# EasyEDA Pro project MCU.epro

# Schematic schematic1
Create Date: 2024-06-15; Page Name: P1; Project Name: OpenBedScanner; Schematic Name: schematic1; Update Date: 2024-06-15; Company: Cartographer3D; Page Size: A4; Version: V1.0
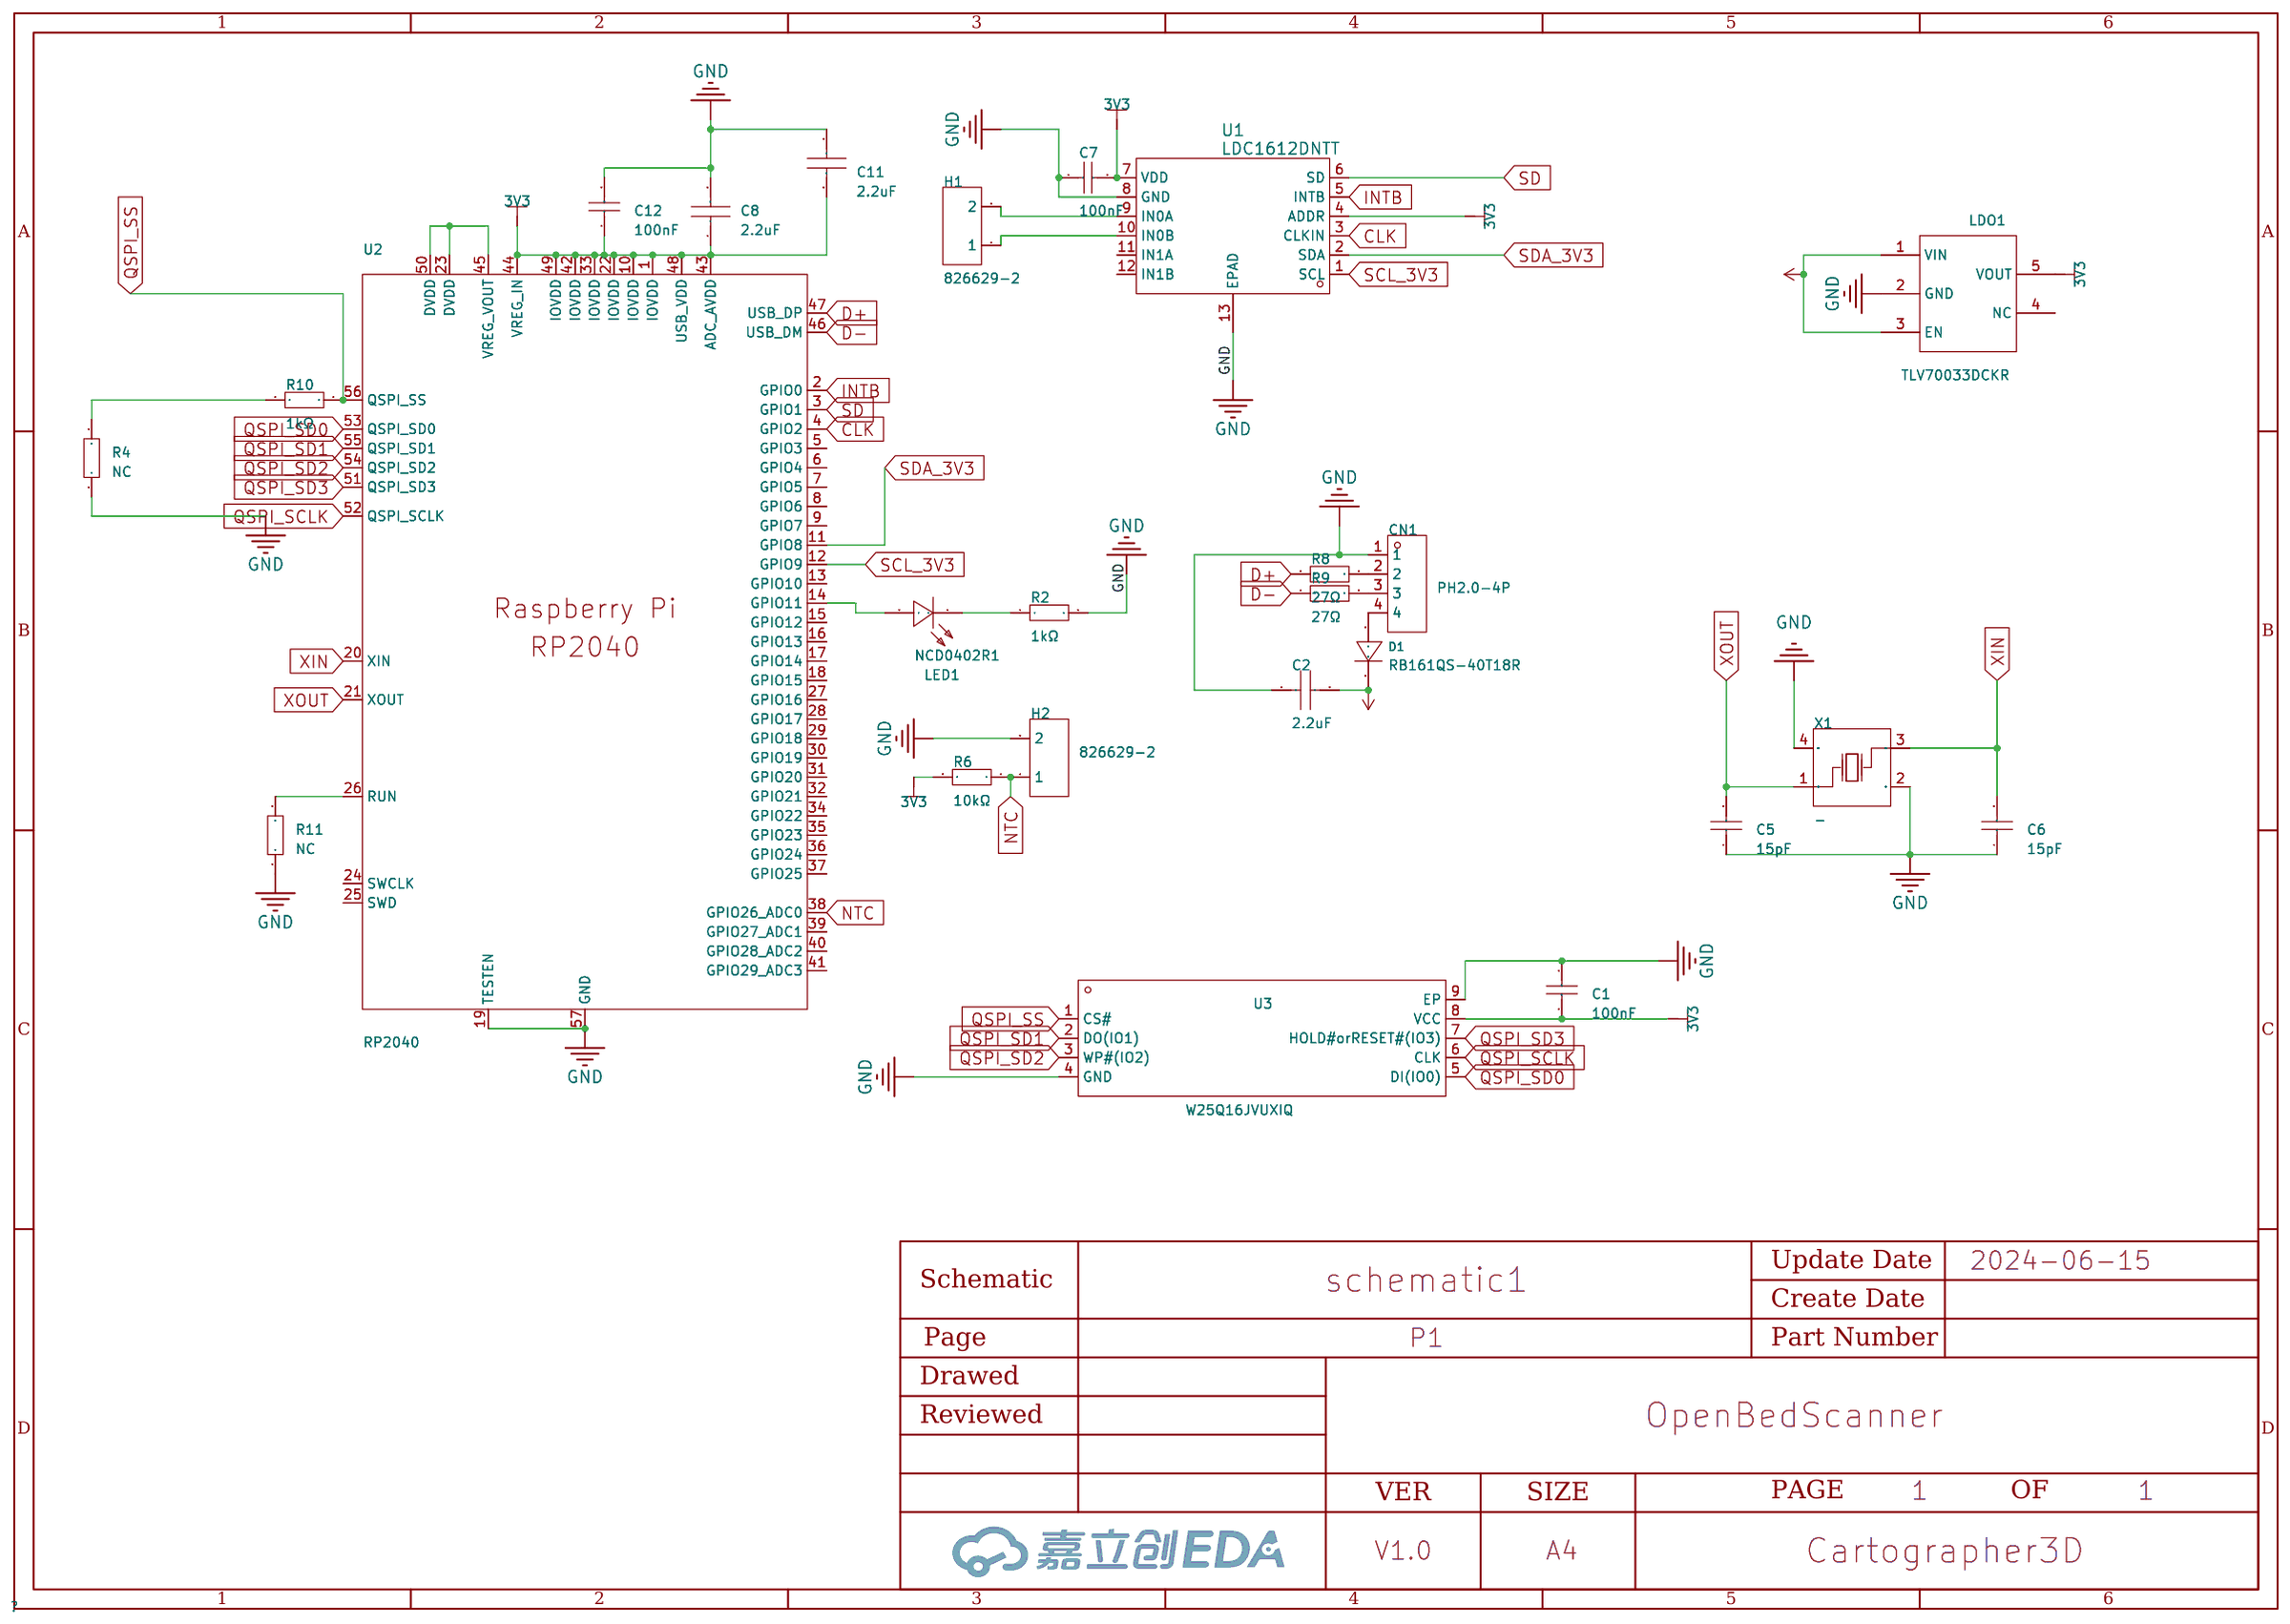
[diagram p0: schematic sheet]

## Parts
C1  100nF  [C0402]
C2  2.2uF  [C0402]
C5  15pF  [C0402]
C6  15pF  [C0402]
C7  100nF  [C0402]
C8  2.2uF  [C0402]
C11  2.2uF  [C0402]
C12  100nF  [C0402]
CN1  PH2.0-4P  [CONN-TH_PH2.0-4P]
D1  RB161QS-40T18R  [X2-DFN1006-2_L1.0-W0.6-P0.65-RD]
H1  826629-2  [HDR-TH_2P-P2.54-V-M-1]
H2  826629-2  [HDR-TH_2P-P2.54-V-M-1]
LDO1  TLV70033DCKR  [SC-70-5_L2.1-W1.3-P0.65-LS2.1-BR]
LED1  NCD0402R1  [R0402]
R2  1kΩ  [R0402]
R4  NC  [R0805]
R6  10kΩ  [R0402]
R8  27Ω  [R0402]
R9  27Ω  [R0402]
R10  1kΩ  [R0402]
R11  NC  [R0805]
U1  LDC1612DNTT  [WSON-12_L4.0-W4.0-P0.50-BL-EP]
U2  RP2040  [LQFN-56_L7.0-W7.0-P0.4-EP]
U3  W25Q16JVUXIQ  [USON-8_L3.0-W2.0-P0.50-BL-EP]
X1  -  [OSC-SMD_4P-L2.5-W2.0-BL]

## Library data of the parts
C1 C7 C12 = 0402B104K160NT: 容值:100nF;精度:±10%;额定电压:16V;材质(温度系数):X7R;; LCSC Part Name: 100nF ±10% 16V; Supplier Part: C41851; Manufacturer: FH(风华); Supplier Footprint: 0402; JLCPCB Part Class: Extended Part; Datasheet: https://atta.szlcsc.com/upload/public/pdf/source/20170923/C41851_1506149456453988767.pdf; Supplier: LCSC; Tolerance: ±10%; Voltage Rated: 16V; Temperature Coefficient: X7R
C2 C8 C11 = CL05A225MQ5NSNC: 容值:2.2uF;精度:±20%;额定电压:6.3V;材质(温度系数):X5R;; LCSC Part Name: 2.2uF ±20% 6.3V; Supplier Part: C12530; Manufacturer: SAMSUNG(三星); Supplier Footprint: 0402; JLCPCB Part Class: Basic Part; Datasheet: https://atta.szlcsc.com/upload/public/pdf/source/20160103/1457707666860.pdf; Supplier: LCSC; Tolerance: ±20%; Voltage Rated: 6.3V; Temperature Coefficient: X5R
C5 C6 = 0402CG150J500NT: 容值:15pF;精度:±5%;额定电压:50V;材质(温度系数):C0G;; LCSC Part Name: 15pF ±5% 50V; Supplier Part: C1548; Manufacturer: FH(风华); Supplier Footprint: 0402; JLCPCB Part Class: Basic Part; Datasheet: https://atta.szlcsc.com/upload/public/pdf/source/20170923/C1548_1506149266133988355.pdf; Supplier: LCSC; Tolerance: ±5%; Voltage Rated: 50V; Temperature Coefficient: C0G
CN1 = PH2.0-4P_C722763: LCSC Part Name: 4P 2.0mm; Supplier Part: C722763; Manufacturer: CAX(创都); JLCPCB Part Class: Extended Part; Datasheet: https://atta.szlcsc.com/upload/public/pdf/source/20200831/C722752_2CEED1D72592B01C53DF3269E60027F0.pdf; Supplier: LCSC
D1 = RB161QS-40T18R: Supplier Part: C2837790; Manufacturer: ROHM(罗姆); Supplier Footprint: 0402; JLCPCB Part Class: 扩展库; Supplier: LCSC
H1 H2 = 826629-2: 排数:单排;总PIN位数:2;间距:2.54mm;插针结构:1x2P;行距:-;安装类型:直插;圆针/方针:-;额定电流:-;额定电压:-;配合针长度:-;塑高:2.8mm;触头材质:黄铜;触头镀层:-;颜色:绿色;; LCSC Part Name: 2.54mm 1x2P 直插; Supplier Part: C86471; Manufacturer: TE Connectivity(美国泰科); Supplier Footprint: 插件,P=2.54mm; JLCPCB Part Class: Extended Part; Datasheet: https://atta.szlcsc.com/upload/public/pdf/source/20161105/1478330325829.pdf; Supplier: LCSC; Number of Rows: 单排; Number of Pins: 2; Pitch: 2.54mm; Pin Structure: 1x2P; Mounting Type: 直插; Insulation Height: 2.8mm; Contact Material: 黄铜; Color: 绿色
LDO1 = TLV70033DCKR: 输出类型:固定;最大输入电压:5.5V;输出电压:3.3V;最大输出电流:200mA;电源纹波抑制比(PSRR):68dB@(1kHz);输出极性:正极;; LCSC Part Name: 输入5.5V 输出3.3V 200mA; Supplier Part: C47945; Manufacturer: TI(德州仪器); Supplier Footprint: SC-70-5; JLCPCB Part Class: Extended Part; Datasheet: https://www.ti.com/cn/lit/gpn/tlv700; Supplier: LCSC; Output Type: 固定; Maximum Input Voltage: 5.5V; Output Voltage: 3.3V; MAX Output Current: 200mA; Power Supply Rejection Ratio (PSRR): 68dB@(1kHz); Dropout Voltage: 250mV@(200mA); standby current: 55uA; Operating Temperature: -40℃~+125℃@(Tj); Output Polarity: 正极; Number of Outputs: 1; Output Current: 500mA
LED1 = NCD0402R1: 发光颜色:红灯;; LCSC Part Name: 红灯; Supplier Part: C130719; Manufacturer: 国星光电; Supplier Footprint: 0402; JLCPCB Part Class: Extended Part; Datasheet: https://atta.szlcsc.com/upload/public/pdf/source/20200820/C130719_A72EA5A7FEC83C35856EA0453E4EE775.pdf; Supplier: LCSC; Emitted Color: 红灯
R2 R10 = 0402WGF1001TCE: 电阻类型:厚膜电阻;阻值:1kΩ;精度:±1%;功率:62.5mW;; LCSC Part Name: 1kΩ ±1% 62.5mW; Supplier Part: C11702; Manufacturer: UNI-ROYAL(厚声); Supplier Footprint: 0402; JLCPCB Part Class: Basic Part; Datasheet: https://atta.szlcsc.com/upload/public/pdf/source/20200306/C422600_1E6D84923E4A46A82E41ADD87F860B5C.pdf; Supplier: LCSC; Type: 厚膜电阻; Tolerance: ±1%; Power(Watts): 62.5mW; Temperature Coefficient: ±100ppm/℃; Overload Voltage (Max): 50V; Operating Temperature Range: -55℃~+155℃
R4 R11 = 0805W8F1002T5E_C17414: 电阻类型:厚膜电阻;阻值:10kΩ;精度:±1%;功率:125mW;; LCSC Part Name: 10kΩ ±1% 125mW; Supplier Part: C17414; Manufacturer: UNI-ROYAL(厚声); Manufacturer Part: 0805W8F1002T5E; Supplier Footprint: 0805; JLCPCB Part Class: Basic Part; Datasheet: https://atta.szlcsc.com/upload/public/pdf/source/20200306/C422600_1E6D84923E4A46A82E41ADD87F860B5C.pdf; Supplier: LCSC; Type: 厚膜电阻; Tolerance: ±1%; Power(Watts): 125mW; Temperature Coefficient: ±100ppm/℃; Overload Voltage (Max): 150V; Operating Temperature Range: -55℃~+155℃
R6 = 0402WGF1002TCE: 电阻类型:厚膜电阻;阻值:10kΩ;精度:±1%;功率:62.5mW;; LCSC Part Name: 10kΩ ±1% 62.5mW; Supplier Part: C25744; Manufacturer: UNI-ROYAL(厚声); Supplier Footprint: 0402; JLCPCB Part Class: Basic Part; Datasheet: https://atta.szlcsc.com/upload/public/pdf/source/20200306/C422600_1E6D84923E4A46A82E41ADD87F860B5C.pdf; Supplier: LCSC; Type: 厚膜电阻; Tolerance: ±1%; Power(Watts): 62.5mW; Temperature Coefficient: ±100ppm/℃; Overload Voltage (Max): 50V; Operating Temperature Range: -55℃~+155℃
R8 R9 = 0402WGF270JTCE: 电阻类型:厚膜电阻;阻值:27Ω;精度:±1%;功率:62.5mW;; LCSC Part Name: 27Ω ±1% 62.5mW; Supplier Part: C25100; Manufacturer: UNI-ROYAL(厚声); Supplier Footprint: 0402; JLCPCB Part Class: Extended Part; Datasheet: https://atta.szlcsc.com/upload/public/pdf/source/20200306/C422600_1E6D84923E4A46A82E41ADD87F860B5C.pdf; Supplier: LCSC; Type: 厚膜电阻; Tolerance: ±1%; Power(Watts): 62.5mW; Temperature Coefficient: ±100ppm/℃; Overload Voltage (Max): 50V; Operating Temperature Range: -55℃~+155℃
U1 = LDC1612DNTT: 传感器类型:电感数字转换器;接口类型:I2C;; LCSC Part Name: I2C接口的电感数字转换器; Supplier Part: C202191; Manufacturer: TI(德州仪器); Supplier Footprint: DFN-12-EP(4x4); JLCPCB Part Class: Extended Part; Datasheet: https://atta.szlcsc.com/upload/public/pdf/source/20180404/C202191_B3F4A6105DA924F93340B0D40FD0E62B.pdf; Supplier: LCSC; Type: 电感数字转换器; The interface type: I2C
U2 = RP2040_C2040: 应用领域:-;CPU内核:ARM-M系列;CPU最大主频:133MHz;工作电压范围:-;程序存储容量:-;程序存储器类型:-;RAM总容量:264KB;GPIO端口数量:30;; LCSC Part Name: ARM-M系列 133MHz; Supplier Part: C2040; Manufacturer: Raspberry Pi(树莓派); Supplier Footprint: LQFN-56(7x7); JLCPCB Part Class: Extended Part; Datasheet: https://atta.szlcsc.com/upload/public/pdf/source/20210621/C2040_96F425825606B7957D87DD32E2512CA9.pdf; Supplier: LCSC; CPU Core: ARM-M系列; CPU Maximum Speed: 133MHz; RAM Size: 264KB; GPIO Ports Number: 30; ADC (Bit): 12bit; UART/USART: 2; I2C: 2; SPI: 2; Universal Serial Bus: 有; Peripheral/Function: DMA；PWM; Direct Memory Access: 有
U3 = W25Q16JVUXIQ: 128Mbit(16MBx8bit),高速版,133MHz(266/532MHz Dual/Quad-SPI,66MB/S),比W25Q128FVSIG,W25Q128FVFIG更高速; Supplier Part: C2843335; Manufacturer: WINBOND(华邦); Supplier Footprint: USON-8; JLCPCB Part Class: Extended Part; Datasheet: https://atta.szlcsc.com/upload/public/pdf/source/20210629/C2843335_FB4D78B5076715625DC0C83F790D3044.pdf; Supplier: LCSC
X1 = XYDBPCNANF-12MHZ: 频率:-;负载电容:-;; LCSC Part Name: 12MHz 12pF ±10ppm -20~+70℃; Supplier Part: C521567; Manufacturer: TAITIEN(泰艺电子); Supplier Footprint: SMD2520-4P; JLCPCB Part Class: Extended Part; Datasheet: https://atta.szlcsc.com/upload/public/pdf/source/20200427/C521567_8D8DDB0F2E066B5BAD7A5878EBE465E2.pdf; Supplier: LCSC; Frequency Tolerance: ±10ppm; Frequency Stability: ±30ppm; Equivalent Series Resistance (ESR): 100Ω

## Nets
3V3: C1.1 C7.2 C8.1 C11.2 C12.1 LDO1.5(VOUT) R6.2 U1.4(ADDR) U1.7(VDD) U2.1(IOVDD) U2.10(IOVDD) U2.22(IOVDD) U2.33(IOVDD) U2.42(IOVDD) U2.43(ADC_AVDD) U2.44(VREG_IN) U2.48(USB_VDD) U2.49(IOVDD) U3.8(VCC)
5V: C2.2 D1.1(C) LDO1.1(VIN) LDO1.3(EN)
GND: C1.2 C2.1 C5.1 C6.1 C7.1 C8.2 C11.1 C12.2 CN1.1 H2.2 LDO1.2(GND) R2.2 R4.2 R11.1 U1.8(GND) U1.13(EPAD) U2.19(TESTEN) U2.57(GND) U3.4(GND) U3.9(EP) X1.2(GND) X1.4(GND)
CLK: U1.3(CLKIN) U2.4(GPIO2)
D+: R8.1 U2.47(USB_DP)
D-: R9.1 U2.46(USB_DM)
INTB: U1.5(INTB) U2.2(GPIO0)
NTC: H2.1 R6.1 U2.38(GPIO26_ADC0)
QSPI_SCLK: U2.52(QSPI_SCLK) U3.6(CLK)
QSPI_SD0: U2.53(QSPI_SD0) U3.5(DI(IO0))
QSPI_SD1: U2.55(QSPI_SD1) U3.2(DO(IO1))
QSPI_SD2: U2.54(QSPI_SD2) U3.3(WP#(IO2))
QSPI_SD3: U2.51(QSPI_SD3) U3.7(HOLD#orRESET#(IO3))
QSPI_SS: R10.1 U2.56(QSPI_SS) U3.1(CS#)
SCL_3V3: U1.1(SCL) U2.12(GPIO9)
SD: U1.6(SD) U2.3(GPIO1)
SDA_3V3: U1.2(SDA) U2.11(GPIO8)
XIN: C6.2 U2.20(XIN) X1.3(OSC2)
XOUT: C5.2 U2.21(XOUT) X1.1(OSC1)
$1N432: H1.2 U1.9(IN0A)
$1N433: H1.1 U1.10(IN0B)
$1N11008: LED1.2(A) U2.14(GPIO11)
$1N12665: R11.2 U2.26(RUN)
$1N12815: CN1.2 R8.2
$1N12851: CN1.3 R9.2
$1N12963: R4.1 R10.2
$1N24859: U2.23(DVDD) U2.45(VREG_VOUT) U2.50(DVDD)
$1N45974: CN1.4 D1.2(A)
$1N47849: LED1.1(K) R2.1

Not connected (* = marked no-connect by the designer): LDO1 4(NC); U1 11(IN1A) 12(IN1B); U2 5(GPIO3) 6(GPIO4) 7(GPIO5) 8(GPIO6) 9(GPIO7) 13(GPIO10) 15(GPIO12) 16(GPIO13) 17(GPIO14) 18(GPIO15) 24(SWCLK) 25(SWD) 27(GPIO16) 28(GPIO17) 29(GPIO18) 30(GPIO19) 31(GPIO20) 32(GPIO21) 34(GPIO22) 35(GPIO23) 36(GPIO24) 37(GPIO25) 39(GPIO27_ADC1) 40(GPIO28_ADC2) 41(GPIO29_ADC3)

# Board PCB1
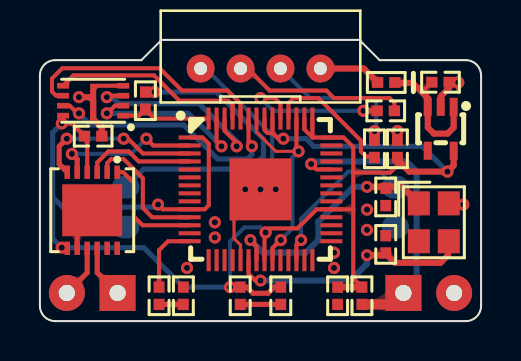
[diagram p1: board, top side]
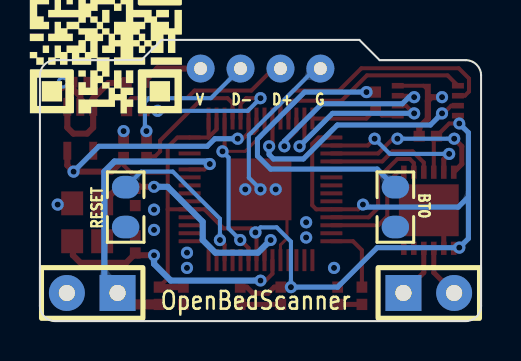
[diagram p2: board, bottom side, seen from below]

Outline 22.1 x 14.1 mm; copper layers: Top Layer, Bottom Layer. Coordinates in mm from the lower left corner of the outline.
Outline path: 0,12.32 0,0.76 arc(0.22,0.22) 0.76,0 21.34,0 arc(21.87,0.22) 22.1,0.76 22.1,12.32 arc(21.87,12.86) 21.34,13.08 17.02,13.08 16,14.1 6.1,14.1 5.08,13.08 0.76,13.08 arc(0.22,12.86) 0,12.32
Stack: Top Layer 0.035mm - / Dielectric1 1.51mm FR4 er 4.5 / Bottom Layer 0.035mm -

## Design rules (mm)
template: 自定义配置
spacing copperThickness1oz (default): track to track 0.102, other pairs 0.152 to 0.3
spacing copperThickness2oz: track to track 0.203, other pairs 0.152 to 0.3
track width copperThickness1oz (default): min 0.127, default 0.254, max 2.54
track width copperThickness2oz: min 0.203, default 0.254, max 2.54
differential pair differentialPair (default): width min 0.127, default 0.254, max 2.54; gap min 0.152, default 0.152
via viaSize (default): diameter min 0.5, default 0.61, max 10; hole min 0.3, default 0.305, max 6.3

## Placement (name value [footprint] x y rotation side)
C1  100nF  [C0402]  2.67 9.27 0 top
C2  2.2uF  [C0402]  20.07 11.98 180 top
C5  15pF  [C0402]  17.32 6.22 90 top
C6  15pF  [C0402]  17.32 3.85 270 top
C7  100nF  [C0402]  10.03 1.27 90 top
C8  2.2uF  [C0402]  12.06 1.27 270 top
C11  2.2uF  [C0402]  17.91 8.64 270 top
C12  100nF  [C0402]  14.91 1.27 270 top
CN1  PH2.0-4P  [CONN-TH_PH2.0-4P]  11.05 12.66 0 top
D1  RB161QS-40T18R  [X2-DFN1006-2_L1.0-W0.6-P0.65-RD]  17.35 11.96 180 top
H1  826629-2  [HDR-TH_2P-P2.54-V-M-1]  2.62 1.41 180 bottom
H2  826629-2  [HDR-TH_2P-P2.54-V-M-1]  19.48 1.41 0 bottom
LDO1  TLV70033DCKR  [SC-70-5_L2.1-W1.3-P0.65-LS2.1-BR]  20.08 9.64 90 top
LED1  NCD0402R1  [R0402]  5.97 1.27 90 top
R2  1kΩ  [R0402]  7.19 1.27 90 top
R4  NC  [R0805]  4.29 5.71 270 bottom
R6  10kΩ  [R0402]  16.13 1.27 90 top
R8  27Ω  [R0402]  17.32 10.54 0 top
R9  27Ω  [R0402]  16.76 8.64 90 top
R10  1kΩ  [R0402]  5.28 11.05 90 top
R11  NC  [R0805]  17.81 5.71 90 bottom
U1  LDC1612DNTT  [WSON-12_L4.0-W4.0-P0.50-BL-EP]  2.62 5.56 180 top
U2  RP2040  [LQFN-56_L7.0-W7.0-P0.4-EP]  11.05 6.6 0 top
U3  W25Q16JVUXIQ  [USON-8_L3.0-W2.0-P0.50-BL-EP]  2.67 11.05 90 top
X1  -  [OSC-SMD_4P-L2.5-W2.0-BL]  19.73 4.95 270 top

## Footprints (pads in the part's own frame, mm; a bottom-side part is the same pattern mirrored in y, then rotated)
C0402
  rect 0.566x0.54 smd: 1(-0.433,0) 2(0.433,0)
CONN-TH_PH2.0-4P
  round 1.4 hole 0.65: 1(-3,0) 2(-1,0) 3(1,0) 4(3,0)
HDR-TH_2P-P2.54-V-M-1
  rect 1.8x1.8 hole 0.813: 1(-1.27,0)
  round 1.8 hole 0.813: 2(1.27,0)
LQFN-56_L7.0-W7.0-P0.4-EP
  rect 1.1x0.2 smd: 1(-3.55,2.6) 2(-3.55,2.2) 3(-3.55,1.8) 4(-3.55,1.4) 5(-3.55,1) 6(-3.55,0.6) 7(-3.55,0.2) 8(-3.55,-0.2) 9(-3.55,-0.6) 10(-3.55,-1) 11(-3.55,-1.4) 12(-3.55,-1.8) 13(-3.55,-2.2) 14(-3.55,-2.6) 29(3.55,-2.6) 30(3.55,-2.2) 31(3.55,-1.8) 32(3.55,-1.4) 33(3.55,-1) 34(3.55,-0.6) 35(3.55,-0.2) 36(3.55,0.2) 37(3.55,0.6) 38(3.55,1) 39(3.55,1.4) 40(3.55,1.8) 41(3.55,2.2) 42(3.55,2.6)
  rect 0.2x1.1 smd: 15(-2.6,-3.55) 16(-2.2,-3.55) 17(-1.8,-3.55) 18(-1.4,-3.55) 19(-1,-3.55) 20(-0.6,-3.55) 21(-0.2,-3.55) 22(0.2,-3.55) 23(0.6,-3.55) 24(1,-3.55) 25(1.4,-3.55) 26(1.8,-3.55) 27(2.2,-3.55) 28(2.6,-3.55) 43(2.6,3.55) 44(2.2,3.55) 45(1.8,3.55) 46(1.4,3.55) 47(1,3.55) 48(0.6,3.55) 49(0.2,3.55) 50(-0.2,3.55) 51(-0.6,3.55) 52(-1,3.55) 53(-1.4,3.55) 54(-1.8,3.55) 55(-2.2,3.55) 56(-2.6,3.55)
  rect 3.1x3.1 smd: 57(0,0)
OSC-SMD_4P-L2.5-W2.0-BL
  rect 1.2x1.1 smd: 1(-0.95,-0.75) 2(0.95,-0.75) 3(0.95,0.75) 4(-0.95,0.75)
R0402
  rect 0.566x0.54 smd: 1(-0.433,0) 2(0.433,0)
R0805
  rrect 1.133x1.377 smd: 1(-1,0) 2(1,0)
SC-70-5_L2.1-W1.3-P0.65-LS2.1-BR
  rect 0.9x0.4 smd: 1(1.1,-0.65) 2(1.1,0) 3(1.1,0.65) 4(-1.1,0.65) 5(-1.1,-0.65)
USON-8_L3.0-W2.0-P0.50-BL-EP
  rect 0.28x0.6 smd: 1(-0.75,-1.508) 2(-0.25,-1.508) 3(0.25,-1.508) 4(0.75,-1.508) 5(0.75,1.508) 6(0.25,1.508) 7(-0.25,1.508) 8(-0.75,1.508)
  rect 1.7x0.3 smd: 9(0,0)
WSON-12_L4.0-W4.0-P0.50-BL-EP
  rect 0.28x0.665 smd: 1(-1.25,-1.907) 2(-0.75,-1.907) 3(-0.25,-1.907) 4(0.25,-1.907) 5(0.75,-1.907) 6(1.25,-1.907) 7(1.25,1.907) 8(0.75,1.907) 9(0.25,1.907) 10(-0.25,1.907) 11(-0.75,1.907) 12(-1.25,1.907)
  rect 3x2.6 smd: 13(0,0)
X2-DFN1006-2_L1.0-W0.6-P0.65-RD
  rect 0.566x0.541 smd: 1(-0.433,0) 2(0.433,0)

## Nets
As in the schematic.

Pads without a net: LDO1 4; U1 11 12; U2 5 6 7 8 9 13 15 16 17 18 24 25 27 28 29 30 31 32 34 35 36 37 39 40 41

## Via types
v1: diameter 0.61, hole 0.305, Top Layer to Bottom Layer, 37 vias
v2: diameter 0.6, hole 0.3, Top Layer to Bottom Layer, 6 vias

## Routing (per net, layer and track width the routed paths; a pad name or vN(x,y) marks a point on that pad's centre or on a via; arc(x,y) is an arc through that point)
3V3: length 76.5
  Top Layer w0.203: U1.4 2.37,9.14 C1.1 1.6,9.91 v2(1.09,9.91) 1.16,9.97 U3.8 ; U2.48 11.65,9.43 ; 11.65,9.43 11.4,9.43 11.25,9.58 U2.49 ; 11.65,9.43 11.94,9.14 v1(12.19,9.14) ; U2.43 13.65,9.21 ; 13.65,9.21 13.25,9.61 U2.44 ; 13.65,9.21 13.66,9.2 U2.42 15.21,9.2 15.7,8.72 15.7,7.44 ; v2(5.92,5.84) 6.16,5.6 U2.10 8.25,5.6 8.46,5.81 8.46,8.89 8.14,9.2 U2.1 ; U2.22 11.25,4.44 v1(11.3,4.44) 11.51,4.65 12.9,4.65 13.86,5.6 U2.33 15.7,5.6 ; R6.2 15.7,2.13 15.7,5.6 ; v1(1.09,3.68) 1.34,3.68 U1.7 ; 15.7,7.44 15.7,5.6 ; 15.7,7.44 17.54,7.44 17.91,7.81 17.91,8.09
  Top Layer w0.254: v1(9.53,1.7) 10.03,1.7 ; C8.1 11.74,1.7 11.43,1.4 10.67,1.4 10.36,1.7 C7.2
  Top Layer w0.305: LDO1.5 20.73,7.81 v1(20.41,7.49) 18.5,7.49 17.91,8.09 ; C12.1 R6.2
  Bottom Layer w0.203: v1(9.53,1.7) 9.53,3.99 10.24,4.7 11.05,4.7 v1(11.3,4.44)
  Bottom Layer w0.254: v1(9.53,1.7) 7.19,1.7 5.21,3.68 v1(1.09,3.68) 0.64,4.14 0.64,6.22 ; v2(5.92,5.84) 5.79,5.71 1.14,5.71 0.64,6.22 ; v1(12.19,9.14) 13.34,9.14 13.72,8.76 19.14,8.76 v1(20.41,7.49) ; 0.64,6.22 0.64,9.45 v2(1.09,9.91)
5V: length 6.8
  Top Layer w0.203: C2.2 19.14,11.48 19.13,11.48
  Top Layer w0.305: 17.67,11.94 18.67,11.94 19.43,11.18 19.43,9.7 19.74,9.4 20.42,9.4 20.73,9.7 LDO1.1
GND: length 24.3
  Top Layer w0.152: U2.19 10.05,3.82 9.72,4.14 9.72,6.55 9.78,6.6 v1(10.29,6.6) v1(11.05,6.6)
  Top Layer w0.203: U3.9 2.67,11.6 2.87,11.8 U3.4
  Top Layer w0.254: C2.1 20.94,11.98 v1(20.96,11.96) 20.96,11.67 ; C8.2 C7.1 ; 1.87,3.56 1.87,4.81 U1.13
  Top Layer w0.305: C1.2 3.1,9.7 2.67,10.13 U3.9 2.49,11.23 v1(1.96,11.23) ; LDO1.2 20.08,11.27 20.5,11.69 C2.1
  Bottom Layer w0.203: CN1.1 8.29,12.66 11.63,9.32 11.63,7.19 v1(11.05,6.6)
  vias: v1(7.37,2.67) v1(8.76,4.95) v1(8.76,4.19) v1(11.81,6.6) v1(14.73,3.43) v1(14.73,2.67) v1(16.38,5.59) v1(16.38,4.57) v1(17.91,9.52) v1(21.21,5.84)
CLK: length 5.6
  Top Layer w0.203: U1.3 2.87,7.95 3.43,8.51 4.44,8.51 4.95,8 U2.4
D+: length 8
  Top Layer w0.203: U2.47 12.05,10.89 11.77,11.18 v1(11.05,11.18)
  Top Layer w0.254: v1(16.21,10.54) R8.1
  Bottom Layer w0.203: v1(16.21,10.54) 11.68,10.54 v1(11.05,11.18)
D-: length 6.7
  Top Layer w0.203: U2.46 12.45,10.92 12.7,11.18 13.95,11.18 16.08,9.05 16.08,8.51 16.33,8.25 16.71,8.25 R9.1
INTB: length 7.3
  Top Layer w0.203: U2.2 5.67,8.8 v1(5.33,9.14)
  Top Layer w0.254: v1(1.6,8.38) 1.87,8.11 1.87,7.56
  Bottom Layer w0.203: v1(5.33,9.14) 4.57,8.38 v1(1.6,8.38)
NTC: length 15.4
  Top Layer w0.203: v1(13.59,7.87) 13.86,7.6 U2.38
  Top Layer w0.508: H2.1 18.21,1.37 17.68,0.84 R6.1
  Bottom Layer w0.305: v1(13.59,7.87) 13.72,8 18.36,8 18.87,7.49 18.87,2.07 H2.1
QSPI_SCLK: length 12.4
  Top Layer w0.203: U2.52 10.05,10.91 9.4,11.56 7.11,11.56 5.99,12.67 1.12,12.67 0.61,12.16 0.61,11.51 0.81,11.3 1.16,11.3 U3.6
QSPI_SD0: length 10
  Top Layer w0.203: U3.5 1.68,12.32 5.72,12.32 6.99,11.05 9.45,11.05 9.65,10.85 U2.53
QSPI_SD1: length 8.8
  Top Layer w0.203: 4.05,10.8 3.76,10.8 3.37,10.41 v1(3.35,10.41) ; v1(9.09,8.76) 8.85,9.01 U2.55
  Bottom Layer w0.254: v1(9.09,8.76) 7.44,10.41 v1(3.35,10.41)
QSPI_SD2: length 10
  Top Layer w0.203: v1(9.86,8.76) 9.86,8.94 9.25,9.55 U2.54 ; v1(3.35,11.23) 3.43,11.3 4.05,11.3
  Bottom Layer w0.254: v1(3.35,11.23) 3.61,11.23 3.94,10.9 7.98,10.9 9.86,9.02 v1(9.86,8.76)
QSPI_SD3: length 12.7
  Top Layer w0.203: 1.03,10.8 1.49,10.8 1.88,10.41 v1(1.96,10.41) ; U2.51 10.45,8.93 v1(10.62,8.76)
  Bottom Layer w0.254: v1(10.62,8.76) 10.62,8.35 10.4,8.13 8.9,8.13 7.2,9.83 2.54,9.83 v1(1.96,10.41)
QSPI_SS: length 4.6
  Top Layer w0.203: U3.1 4.97,10.3 R10.1 5.75,10.15 U2.56
SCL_3V3: length 5.7
  Top Layer w0.203: U1.1 4.17,7.46 4.7,6.93 4.7,5.25 5.15,4.8 U2.12
SD: length 8.5
  Top Layer w0.203: U2.3 5.16,8.4 4.42,9.14 v1(4.19,9.14)
  Top Layer w0.254: U1.6 0.97,7.87 0.97,8.76 v1(1.35,9.14)
  Bottom Layer w0.203: v1(4.19,9.14) v1(1.35,9.14)
SDA_3V3: length 6.7
  Top Layer w0.203: U2.11 5.63,5.2 5.16,5.67 5.16,7.16 4.19,8.13 3.57,8.13 3.37,7.92 3.37,7.56
XIN: length 12.7
  Top Layer w0.203: U2.20 10.45,2.38 10.8,2.03 v2(11.05,2.03)
  Top Layer w0.305: 20.48,4 20.45,3.97 20.45,3.3 20.07,2.92 17.78,2.92 17.32,3.38 C6.2 17.21,3.3 v2(16.38,3.3)
  Bottom Layer w0.305: v2(11.05,2.03) 15.54,2.03 16.38,2.87 v2(16.38,3.3)
XOUT: length 12.1
  Top Layer w0.203: v2(10.54,4.06) 10.85,3.76 U2.21
  Top Layer w0.305: X1.1 18.15,6.73 v2(16.38,6.73)
  Bottom Layer w0.305: v2(10.54,4.06) 11.18,3.43 13.31,3.43 13.94,4.07 13.94,4.98 15.7,6.73 v2(16.38,6.73)
$1N432: length 2.6
  Top Layer w0.254: H1.2 2.37,2.43 2.37,3.56
$1N433: length 2.6
  Top Layer w0.254: 2.87,3.56 2.87,2.43 H1.1
$1N11008: length 3.6
  Top Layer w0.203: U2.14 6.42,4 5.97,3.56 LED1.2
$1N12665: length 8.2
  Top Layer w0.203: v1(13.08,4.06) 12.85,3.83 U2.26
  Bottom Layer w0.203: v1(13.08,4.06) 13.08,5.13 15.44,7.49 17.03,7.49 R11.2
$1N12815: length 8.8
  Top Layer w0.203: 17.76,10.54 17.76,10.95 17.53,11.18 14.73,11.18 14.35,11.56 11.51,11.56 10.4,12.66 CN1.2
$1N12851: length 7.4
  Top Layer w0.203: v1(16.76,9.52) 16.76,9.08 16.76,9.07
  Bottom Layer w0.203: CN1.3 13.53,11.18 16.64,11.18 16.84,10.97 16.84,9.6 v1(16.76,9.52)
$1N12963: length 14.8
  Bottom Layer w0.254: v1(5.74,11.48) 8.84,11.48 11.2,9.12 11.2,8.28 10.54,7.62 5.2,7.62 R4.1
$1N24859: length 11
  Top Layer w0.152: U2.50 10.85,9.48 11.82,8.51 v1(12.95,8.51)
  Top Layer w0.203: v1(12.95,8.51) 13.03,8.51 12.85,8.69 U2.45 ; v1(12.06,4.06) 11.86,3.86 11.85,3.86 11.65,3.66 U2.23
  Bottom Layer w0.203: v1(12.95,8.51) 12.65,8.2 12.65,4.65 v1(12.06,4.06)
$1N45974: length 3.2
  Top Layer w0.305: CN1.4 16.22,12.66 D1.2
$1N47849: length 1.2
  Top Layer w0.254: LED1.1 R2.1

## Copper pours and planes (outline as drawn; the poured copper is in the pictures)
GND on Top Layer: -6.81,17.02 32.69,17.02 32.69,-4.06 -6.81,-4.06
GND on Bottom Layer: -12.57,14.86 26.54,14.86 26.54,-8.39 -12.57,-8.39

Small or netless copper shapes (teardrops, artwork), in the pictures only: 106 on Top Layer, 38 on Bottom Layer

## Text on the board
Bottom Silkscreen Layer: BT0 | RESET | G | D+ | D- | V | OpenBedScanner
